# Altium schematic sheet Sheet1.SchDoc
size A4
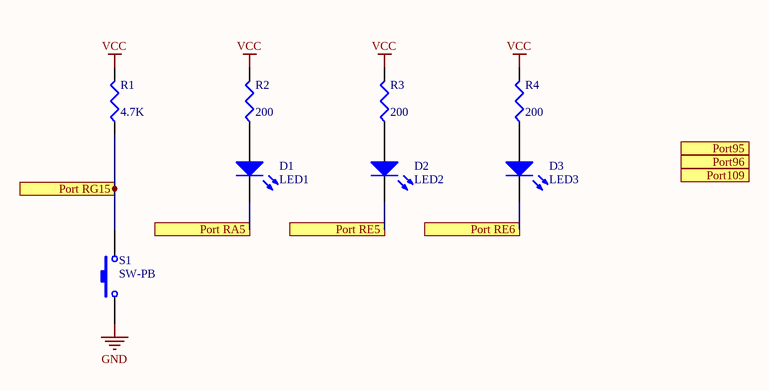
[diagram p0: Sheet1.SchDoc]

## Parts
D1  LED1  [LED-1]
D2  LED2  [3.2X1.6X1.1]
D3  LED3  [3.5X2.8X1.9]
R1  value 4.7K  [J1-0603]
R2  value 200  [J1-0603]
R3  value 200  [J1-0603]
R4  value 200  [J1-0603]
S1  SW-PB  [SPST-2]

## Ports
Port95, Port96, Port109, Port RA5, Port RE5, Port RE6, Port RG15

## Nets
GND: S1.1
VCC: R1.2 R2.2 R3.2 R4.2
Port RA5: D1.2(K) ; port Port RA5
Port RE5: D2.2(K) ; port Port RE5
Port RE6: D3.2(K) ; port Port RE6
Port RG15: R1.1 S1.2 ; port Port RG15
NetD1_1: D1.1(A) R2.1
NetD2_1: D2.1(A) R3.1
NetD3_1: D3.1(A) R4.1

## Library data of the parts
D1 = LED1: Typical RED GaAs LED; Published: 8-Jun-2000; LatestRevisionDate: 08-Jul-2005; LatestRevisionNote: Mech Layer 1 removed.; PackageReference: LED-1; Publisher: Altium Limited; PackageDescription: LED; 2 Leads
D2 = LED2: Typical RED, GREEN, YELLOW, AMBER GaAs LED; Published: 8-Jun-2000; LatestRevisionDate: 17-Jul-2002; LatestRevisionNote: Re-released for DXP Platform.; PackageReference: 3.2X1.6X1.1; Publisher: Altium Limited; PackageDescription: SM LED; 2 Flat Leads; PackageVersion: Feb-2002
D3 = LED3: Typical BLUE SiC LED; Published: 8-Jun-2000; LatestRevisionDate: 17-Dec-2003; LatestRevisionNote: PCB Footprint replaced.; PackageReference: 3.5X2.8X1.9; Publisher: Altium Limited; PackageDescription: SM LED; 2 C-Bend Leads; Body 3.5 x 2.8 x 1.9 mm, inc leads (LxWxH typ); DatasheetVersion: 16-Apr-2002; PackageVersion: 16-Apr-2002
R1-R4 = Res3: Resistor; Published: 8-Jun-2000; LatestRevisionDate: 29-May-2009; LatestRevisionNote: IPC-7351 Footprint Added.; PackageReference: J1-0603; Publisher: Altium Limited; PackageDescription: Chip Resistor
S1 = SW-PB: Switch; Published: 24-Mar-1999; LatestRevisionDate: 17-Jul-2002; LatestRevisionNote: Re-released for DXP Platform.; PackageReference: SPST-2; Publisher: Altium Limited; PackageDescription: Switch; 2 Leads